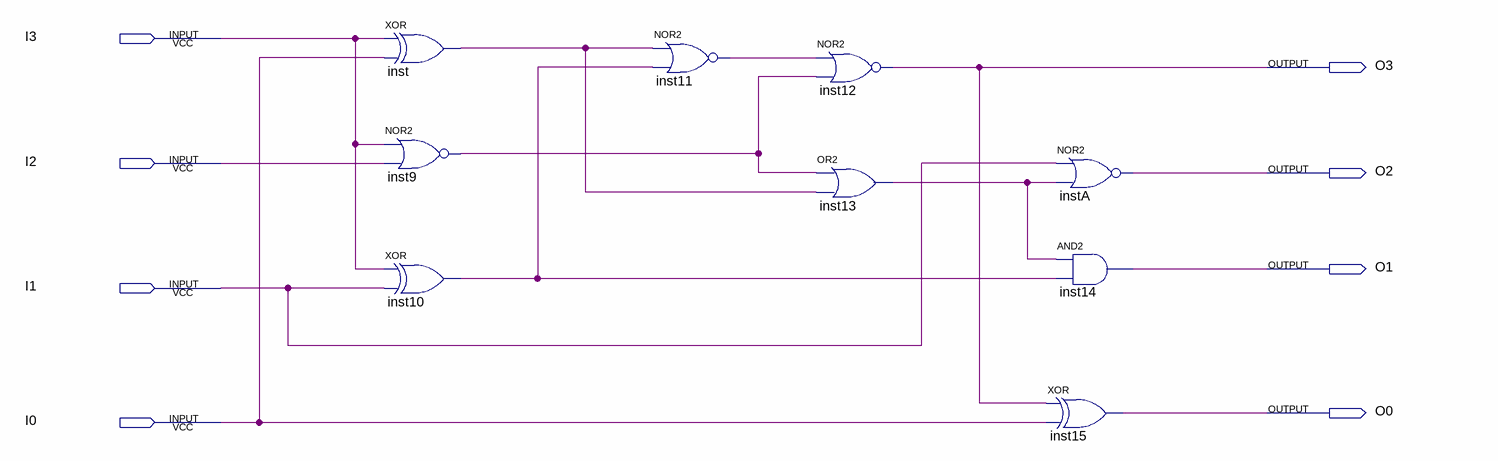
[diagram p0: schematic sheet]
// Quartus schematic DABBLE.bdf as structural Verilog: 9 symbols, 8 pins
module DABBLE (
  input  I3,
  input  I2,
  input  I1,
  input  I0,
  output O3,
  output O2,
  output O1,
  output O0
);

  wire inst9_out, inst10_out, inst11_out, inst13_out, inst_out;

  xor inst (inst_out, I3, I0);
  nor inst9 (inst9_out, I3, I2);
  xor inst10 (inst10_out, I3, I1);
  nor inst11 (inst11_out, inst_out, inst10_out);
  nor inst12 (O3, inst11_out, inst9_out);
  or inst13 (inst13_out, inst9_out, inst_out);
  nor instA (O2, I1, inst13_out);
  and inst14 (O1, inst13_out, inst10_out);
  xor inst15 (O0, O3, I0);
endmodule
